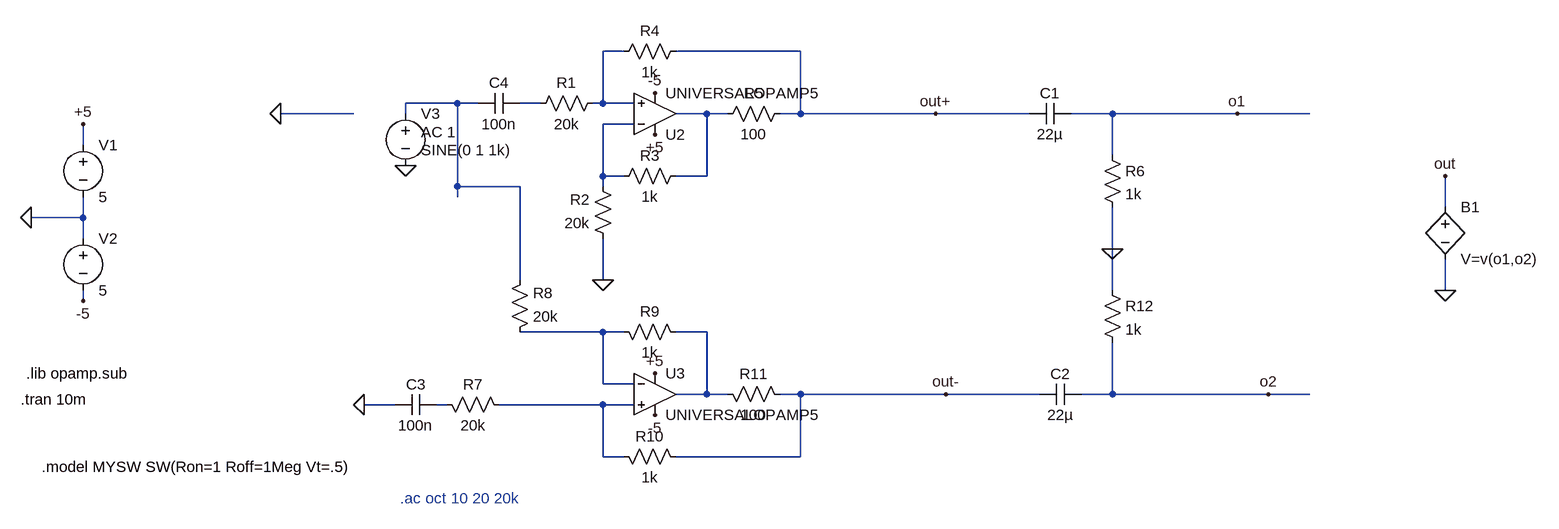
[diagram p0: schematic Talkback.asc]
Talkback.asc, the LTspice schematic file:
Version 4
SHEET 1 2176 680
WIRE 464 -176 432 -176
WIRE 736 -176 544 -176
WIRE 208 -96 128 -96
WIRE 240 -96 208 -96
WIRE 336 -96 304 -96
WIRE 432 -96 432 -176
WIRE 432 -96 416 -96
WIRE 480 -96 432 -96
WIRE 48 -80 -64 -80
WIRE 128 -80 128 -96
WIRE 592 -80 544 -80
WIRE 624 -80 592 -80
WIRE 736 -80 736 -176
WIRE 736 -80 704 -80
WIRE 944 -80 736 -80
WIRE 1088 -80 944 -80
WIRE 1216 -80 1152 -80
WIRE 1408 -80 1216 -80
WIRE 1520 -80 1408 -80
WIRE 480 -64 432 -64
WIRE -368 -32 -368 -64
WIRE 1216 -16 1216 -80
WIRE 432 16 432 -64
WIRE 464 16 432 16
WIRE 592 16 592 -80
WIRE 592 16 544 16
WIRE 208 32 208 -96
WIRE 304 32 208 32
WIRE 432 32 432 16
WIRE 208 48 208 32
WIRE 1728 64 1728 16
WIRE -368 80 -368 48
WIRE -368 80 -448 80
WIRE -368 112 -368 80
WIRE 1216 128 1216 64
WIRE 304 176 304 32
WIRE 432 176 432 112
WIRE 1216 192 1216 128
WIRE 1728 192 1728 144
WIRE -368 208 -368 192
WIRE 432 256 304 256
WIRE 464 256 432 256
WIRE 592 256 544 256
WIRE 432 336 432 256
WIRE 480 336 432 336
WIRE 592 352 592 256
WIRE 592 352 544 352
WIRE 624 352 592 352
WIRE 736 352 704 352
WIRE 960 352 736 352
WIRE 1104 352 960 352
WIRE 1216 352 1216 272
WIRE 1216 352 1168 352
WIRE 1456 352 1216 352
WIRE 1520 352 1456 352
WIRE 112 368 64 368
WIRE 192 368 176 368
WIRE 432 368 272 368
WIRE 480 368 432 368
WIRE 432 448 432 368
WIRE 464 448 432 448
WIRE 736 448 736 352
WIRE 736 448 544 448
FLAG -448 80 0
FLAG -368 208 -5
FLAG -368 -64 +5
FLAG 1216 128 0
FLAG 944 -80 out+
FLAG 960 352 out-
FLAG 512 320 +5
FLAG 512 384 -5
FLAG 64 368 0
FLAG 432 176 0
FLAG 512 -48 +5
FLAG 512 -112 -5
FLAG -64 -80 0
FLAG 1408 -80 o1
FLAG 1456 352 o2
FLAG 1728 192 0
FLAG 1728 16 out
FLAG 128 0 0
SYMBOL voltage -368 -48 R0
WINDOW 123 0 0 Left 0
WINDOW 39 0 0 Left 0
SYMATTR InstName V1
SYMATTR Value 5
SYMBOL voltage -368 96 R0
WINDOW 123 0 0 Left 0
WINDOW 39 0 0 Left 0
SYMATTR InstName V2
SYMATTR Value 5
SYMBOL res 432 -112 R90
WINDOW 0 0 56 VBottom 2
WINDOW 3 32 56 VTop 2
SYMATTR InstName R1
SYMATTR Value 20k
SYMBOL res 448 128 R180
WINDOW 0 36 76 Left 2
WINDOW 3 36 40 Left 2
SYMATTR InstName R2
SYMATTR Value 20k
SYMBOL res 560 0 R90
WINDOW 0 0 56 VBottom 2
WINDOW 3 32 56 VTop 2
SYMATTR InstName R3
SYMATTR Value 1k
SYMBOL res 560 -192 R90
WINDOW 0 0 56 VBottom 2
WINDOW 3 32 56 VTop 2
SYMATTR InstName R4
SYMATTR Value 1k
SYMBOL res 720 -96 R90
WINDOW 0 0 56 VBottom 2
WINDOW 3 32 56 VTop 2
SYMATTR InstName R5
SYMATTR Value 100
SYMBOL res 1200 -32 R0
SYMATTR InstName R6
SYMATTR Value 1k
SYMBOL res 1200 176 R0
SYMATTR InstName R12
SYMATTR Value 1k
SYMBOL cap 1152 -96 R90
WINDOW 0 0 32 VBottom 2
WINDOW 3 32 32 VTop 2
SYMATTR InstName C1
SYMATTR Value 22µ
SYMBOL cap 1168 336 R90
WINDOW 0 0 32 VBottom 2
WINDOW 3 32 32 VTop 2
SYMATTR InstName C2
SYMATTR Value 22µ
SYMBOL res 288 384 M270
WINDOW 0 32 56 VTop 2
WINDOW 3 0 56 VBottom 2
SYMATTR InstName R7
SYMATTR Value 20k
SYMBOL res 288 272 M180
WINDOW 0 36 76 Left 2
WINDOW 3 36 40 Left 2
SYMATTR InstName R8
SYMATTR Value 20k
SYMBOL res 560 272 M270
WINDOW 0 32 56 VTop 2
WINDOW 3 0 56 VBottom 2
SYMATTR InstName R9
SYMATTR Value 1k
SYMBOL res 560 464 M270
WINDOW 0 32 56 VTop 2
WINDOW 3 0 56 VBottom 2
SYMATTR InstName R10
SYMATTR Value 1k
SYMBOL res 720 368 M270
WINDOW 0 32 56 VTop 2
WINDOW 3 0 56 VBottom 2
SYMATTR InstName R11
SYMATTR Value 100
SYMBOL OpAmps\\UniversalOpAmp5 512 352 R0
SYMATTR InstName U3
SYMATTR SpiceLine2 Vos=2m Ibp=2n Ibn=1n Iq=1m Rail=0 Ilimit=25m
SYMBOL OpAmps\\UniversalOpAmp5 512 -80 M180
SYMATTR InstName U2
SYMATTR SpiceLine2 Vos=2m Ibp=2n Ibn=1n Iq=1m Rail=0 Ilimit=25m
SYMBOL bv 1728 48 R0
SYMATTR InstName B1
SYMATTR Value V=v(o1,o2)
SYMBOL voltage 128 -96 R0
WINDOW 123 24 44 Left 2
WINDOW 39 0 0 Left 0
WINDOW 3 24 72 Left 2
SYMATTR Value2 AC 1
SYMATTR Value SINE(0 1 1k)
SYMATTR InstName V3
SYMBOL cap 304 -112 R90
WINDOW 0 0 32 VBottom 2
WINDOW 3 32 32 VTop 2
SYMATTR InstName C4
SYMATTR Value 100n
SYMBOL cap 176 352 R90
WINDOW 0 0 32 VBottom 2
WINDOW 3 32 32 VTop 2
SYMATTR InstName C3
SYMATTR Value 100n
TEXT -464 360 Left 2 !.tran 10m
TEXT -456 320 Left 2 !.lib opamp.sub
TEXT 120 512 Left 2 ;.ac oct 10 20 20k
TEXT -432 464 Left 2 !.model MYSW SW(Ron=1 Roff=1Meg Vt=.5)

The netlist it stands for:
* Talkback.asc
V1 +5 0 5
V2 0 -5 5
R1 N001 N003 20k
R2 0 N005 20k
R3 N004 N005 1k
R4 out+ N001 1k
R5 out+ N004 100
R6 o1 0 1k
R12 0 o2 1k
C1 o1 out+ 22µ
C2 o2 out- 22µ
R7 N009 N008 20k
R8 N006 N002 20k
R9 N007 N006 1k
R10 out- N009 1k
R11 out- N007 100
XU3 N009 N006 +5 -5 N007 level5 Avol=1Meg GBW=10Meg Phimargin=45 SlewPos=10Meg SlewNeg=10Meg En=0 Enk=0 In=0 Ink=0 Rcm=500Meg Ccm=1p Rdiff=500k Cdiff=2p Ro=1k Vos=0 Ibp=2n Ibn=1n Iq=1m Rail=0 Ilimit=25m Vos=2m Ibp=2n Ibn=1n Iq=1m Rail=0 Ilimit=25m  ; UNIVERSALOPAMP5, pins In+ In- V+ V- OUT
XU2 N001 N005 +5 -5 N004 level5 Avol=1Meg GBW=10Meg Phimargin=45 SlewPos=10Meg SlewNeg=10Meg En=0 Enk=0 In=0 Ink=0 Rcm=500Meg Ccm=1p Rdiff=500k Cdiff=2p Ro=1k Vos=0 Ibp=2n Ibn=1n Iq=1m Rail=0 Ilimit=25m Vos=2m Ibp=2n Ibn=1n Iq=1m Rail=0 Ilimit=25m  ; UNIVERSALOPAMP5, pins In+ In- V+ V- OUT
B1 out 0 V=v(o1,o2)
V3 N002 0 SINE(0 1 1k) AC 1
C4 N003 N002 100n
C3 N008 0 100n
.tran 10m
.lib opamp.sub
* .ac oct 10 20 20k
.model MYSW SW(Ron=1 Roff=1Meg Vt=.5)
.backanno
.end